# EAGLE design trigger_switch_pcb (EAGLE 6.5.0)
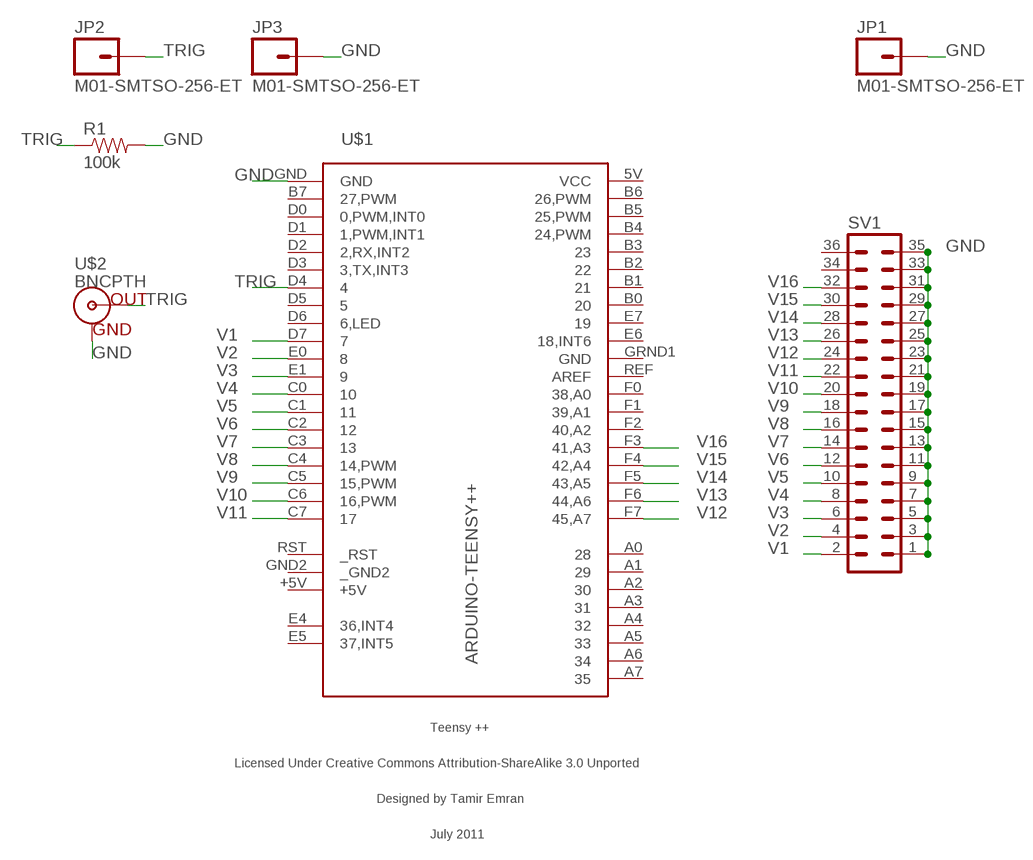
[diagram p0: schematic, sheet 1]

## Parts
JP1  M01-SMTSO-256-ET  [SMTSO-256-ET]
JP2  M01-SMTSO-256-ET  [SMTSO-256-ET]
JP3  M01-SMTSO-256-ET  [SMTSO-256-ET]
R1  100k  RESISTORPTH-1/2W  [AXIAL-0.5]
SV1  MA18-2  [MA18-2]
U$1  ARDUINO-TEENSY++  [TEENSY++]
U$2  BNCPTH  [BNC]

## Nets
GND: JP1.P$1 JP3.P$1 R1.P$2 SV1.1 SV1.3 SV1.5 SV1.7 SV1.9 SV1.11 SV1.13 SV1.15 SV1.17 SV1.19 SV1.21 SV1.23 SV1.25 SV1.27 SV1.29 SV1.31 SV1.33 SV1.35 U$1.GND U$2.GND
TRIG: JP2.P$1 R1.P$1 U$1.D4 U$2.S(OUT)
V1: SV1.2 U$1.D7
V2: SV1.4 U$1.E0
V3: SV1.6 U$1.E1
V4: SV1.8 U$1.C0
V5: SV1.10 U$1.C1
V6: SV1.12 U$1.C2
V7: SV1.14 U$1.C3
V8: SV1.16 U$1.C4(14,PWM)
V9: SV1.18 U$1.C5(15,PWM)
V10: SV1.20 U$1.C6(16,PWM)
V11: SV1.22 U$1.C7
V12: SV1.24 U$1.F7(45,A7)
V13: SV1.26 U$1.F6(44,A6)
V14: SV1.28 U$1.F5(43,A5)
V15: SV1.30 U$1.F4(42,A4)
V16: SV1.32 U$1.F3(41,A3)
Unconnected: SV1.34 SV1.36 U$1.A0 U$1.A1 U$1.A2 U$1.A3 U$1.A4 U$1.A5 U$1.A6 U$1.A7 U$1.B0 U$1.B1 U$1.B2 U$1.B3 U$1.B4(24,PWM) U$1.B5(25,PWM) U$1.B6(26,PWM) U$1.B7(27,PWM) U$1.D0(0,PWM,INT0) U$1.D1(1,PWM,INT1) U$1.D2(2,RX,INT2) U$1.D3(3,TX,INT3) U$1.D5 U$1.D6(6,LED) U$1.E4(36,INT4) U$1.E5(37,INT5) U$1.E6(18,INT6) U$1.E7 U$1.F0(38,A0) U$1.F1(39,A1) U$1.F2(40,A2) U$1.REF(AREF) U$1.RST(_RST)

## Power pins joined to a net without a drawn wire
+5V: U$1.+5V
_GND2: U$1.GND2(_GND2)
GND: U$1.GRND1(GND)
VCC: U$1.5V(VCC)

## Library data of the parts
JP1-JP3 = SparkFun-Connectors:M01: Header 1 Standard 1-pin 0.1" header. Use with straight break away headers (SKU : PRT-00116), right angle break away headers (PRT-00553), swiss pins (PRT-00743), machine pins (PRT-00117), and female headers (PRT-00115).
R1 = SparkFun-Resistors:RESISTOR: Resistor Basic schematic elements and footprints for 0603, 1206, and PTH resistors.
SV1 = con-lstb:MA18-2: PIN HEADER; OC_FARNELL: unknown; OC_NEWARK: unknown
U$1 = teensypp:ARDUINO-TEENSY++: Teensy ++ Original Design by Mark Gross Modified Design by Tamir Emran Licensed Under Creative Commons Attribution-ShareAlike 3.0 Unported (CC BY-SA 3.0)
U$2 = SparkFun-Connectors:BNC: BNC Connector, Mouser Part# 5227161

## Board
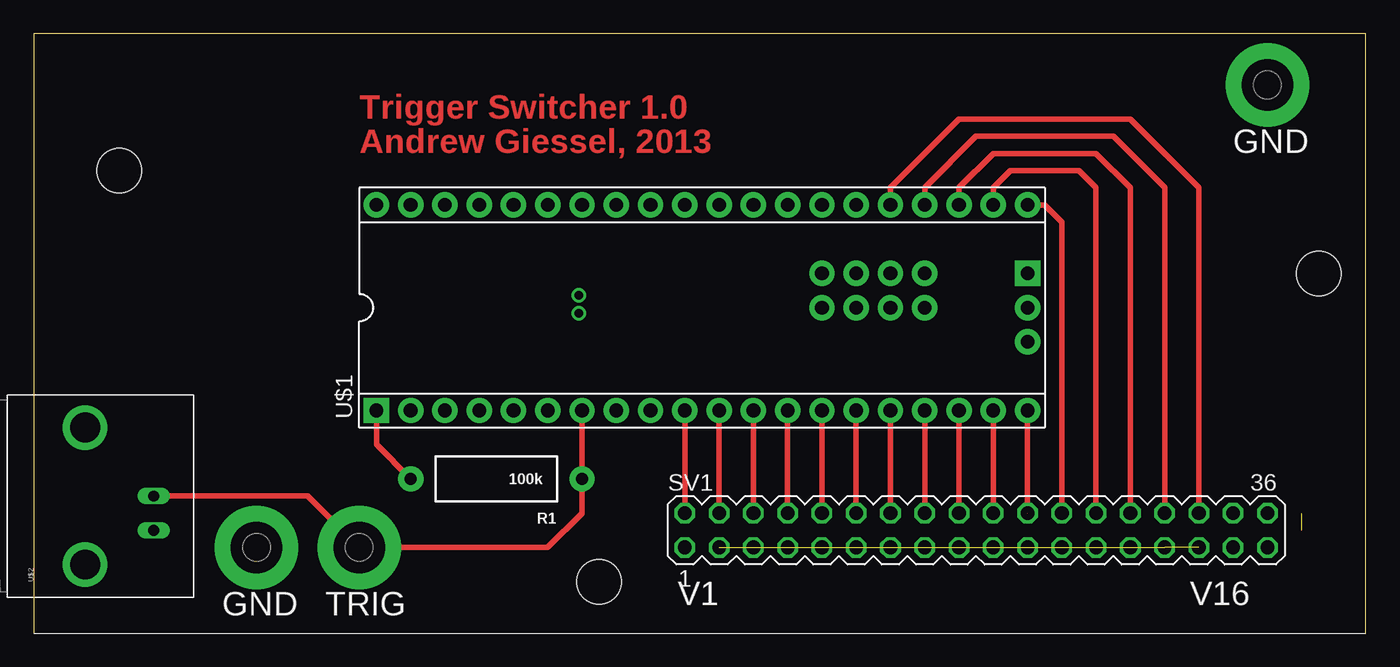
[diagram p1: board, top side]
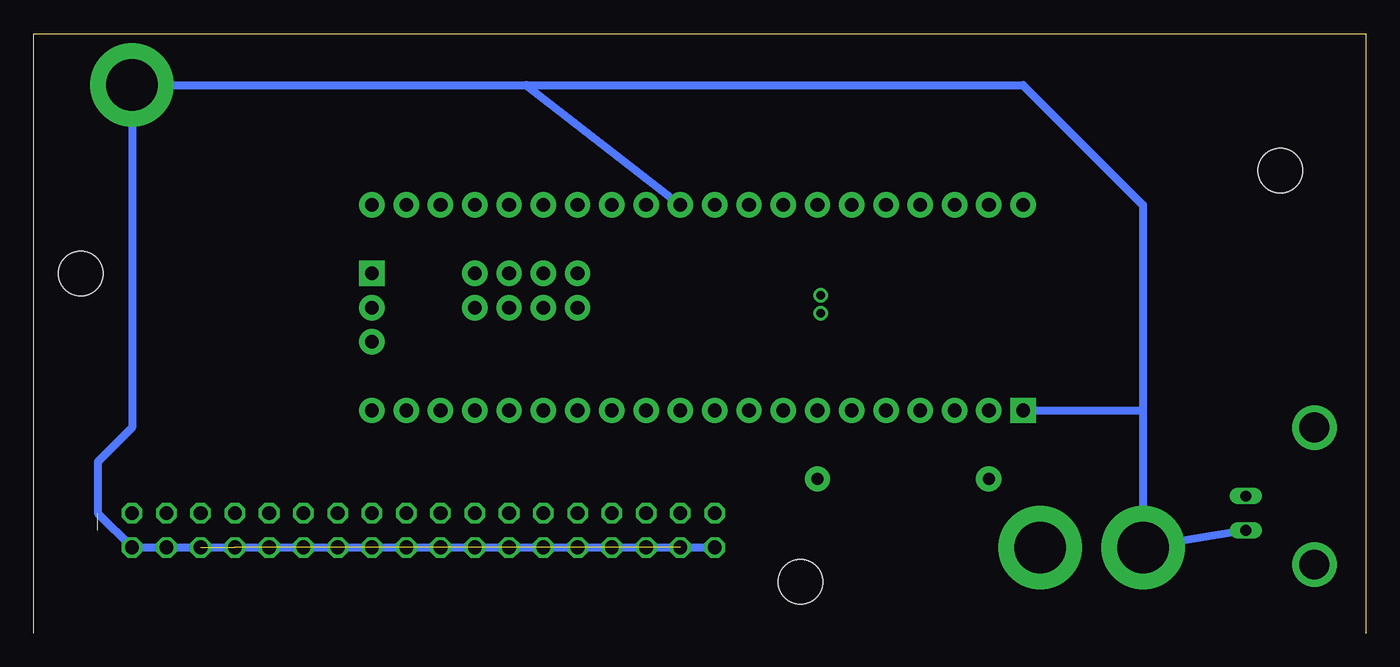
[diagram p2: board, bottom side, seen from below]

Size 98.73 x 44.44 mm. Coordinates in mm from the lower left corner, seen from the top.
Outline: 98.73,0 98.73,44.44 0,44.44 0,0
Copper layers (1*16): Top 0.0178mm / dielectric 59mil / Bottom 0.0178mm
Design rules "SSC-EAGLE-2Lyr_v1.0.0.3": minimum track width 6mil, minimum drill 14mil, track to track 6mil, track to pad 6mil, pad to pad 6mil, via to via 6mil, smd to smd 6mil, copper to edge 20mil, drill to drill 16mil, minimum pad ring 8mil, minimum via ring 8mil, stop-mask expansion 3mil, vias tented up to drill 0mil, thermal gap 10mil

### Footprints (pad centres in the part's own frame; a part is rotated, then mirrored left to right if it is on the bottom)
SMTSO-256-ET = drill 3.81 pad 6.198: P$1 0,0
AXIAL-0.5 = drill 0.9 pad 1.88: P$1 -6.35,0; P$2 6.35,0
MA18-2 = drill 1.016 octagon: 1 -21.59,-1.27; 2 -21.59,1.27; 3 -19.05,-1.27; 4 -19.05,1.27; 5 -16.51,-1.27; 6 -16.51,1.27; 7 -13.97,-1.27; 8 -13.97,1.27; 9 -11.43,-1.27; 10 -11.43,1.27; 11 -8.89,-1.27; 12 -8.89,1.27; 13 -6.35,-1.27; 14 -6.35,1.27; 15 -3.81,-1.27; 16 -3.81,1.27; 17 -1.27,-1.27; 18 -1.27,1.27; 19 1.27,-1.27; 20 1.27,1.27; 21 3.81,-1.27; 22 3.81,1.27; 23 6.35,-1.27; 24 6.35,1.27; 25 8.89,-1.27; 26 8.89,1.27; 27 11.43,-1.27; 28 11.43,1.27; 29 13.97,-1.27; 30 13.97,1.27; 31 16.51,-1.27; 32 16.51,1.27; 33 19.05,-1.27; 34 19.05,1.27; 35 21.59,-1.27; 36 21.59,1.27
TEENSY++ = drill 1.016 pad 1.88: 5V 24.13,-2.54; +5V -24.13,7.62; A0 8.89,0; A1 11.43,0; A2 13.97,0; A3 16.51,0; A4 8.89,2.54; A5 11.43,2.54; A6 13.97,2.54; A7 16.51,2.54; B0 -6.35,7.62; B1 -8.89,7.62; B2 -11.43,7.62; B3 -13.97,7.62; B4 -16.51,7.62; B5 -19.05,7.62; B6 -21.59,7.62; B7 -21.59,-7.62; C0 6.35,-7.62; C1 8.89,-7.62; C2 11.43,-7.62; C3 13.97,-7.62; C4 16.51,-7.62; C5 19.05,-7.62; C6 21.59,-7.62; C7 24.13,-7.62; D0 -19.05,-7.62; D1 -16.51,-7.62; D2 -13.97,-7.62; D3 -11.43,-7.62; D4 -8.89,-7.62; D5 -6.35,-7.62; D6 -3.81,-7.62; D7 -1.27,-7.62; E0 1.27,-7.62; E1 3.81,-7.62; E6 -1.27,7.62; E7 -3.81,7.62; F0 6.35,7.62; F1 8.89,7.62; F2 11.43,7.62; F3 13.97,7.62; F4 16.51,7.62; F5 19.05,7.62; F6 21.59,7.62; F7 24.13,7.62; GND2 24.13,0; GRND1 1.27,7.62; REF 3.81,7.62 | drill 0.635 pad 1.067: E4 -9.144,0.914; E5 -9.144,-0.406 | drill 1.016 pad 1.88 square: GND -24.13,-7.62; RST 24.13,2.54
BNC = drill 2.2: 3 -5.08,5.08; 4 5.08,5.08 | drill 0.8 long: GND -2.54,0; S 0,0
STAND-OFF = hole 3.302: 0,0

### Placement (x,y rotation side)
JP1  91.44,40.64 0 top
JP2  24.13,6.35 0 top
JP3  16.51,6.35 0 top
R1  34.29,11.43 180 top
SV1  69.85,7.62 0 top
U$1  49.53,24.13 0 top
U$2  8.89,10.16 90 top
U$3  [STAND-OFF]  6.35,34.29 0 top
U$4  [STAND-OFF]  95.25,26.67 0 top
U$6  [STAND-OFF]  41.91,3.81 0 top

### Tracks (layer width: path | path; a pad name or v marks a point on that pad's centre or on a via)
GND  (15 unrouted)
  Top 0.406: R1.P$2 25.4,13.97 U$1.GND
  Bottom 0.61: U$2.GND JP3.P$1 16.51,16.51 | 62.23,40.64 JP1.P$1 91.44,15.24 93.98,12.7 93.98,8.89 SV1.35 SV1.33 SV1.31 SV1.1 | 62.23,40.64 25.4,40.64 16.51,31.75 16.51,16.51 | U$1.GRND1 62.23,40.64 | U$1.GND 16.51,16.51
TRIG
  Top 0.406: U$1.D4 R1.P$1 40.64,8.89 38.1,6.35 JP2.P$1 20.32,10.16 U$2.S
V1
  Top 0.406: U$1.D7 SV1.2
V2
  Top 0.406: U$1.E0 SV1.4
V3
  Top 0.406: U$1.E1 SV1.6
V4
  Top 0.406: U$1.C0 SV1.8
V5
  Top 0.406: U$1.C1 SV1.10
V6
  Top 0.406: U$1.C2 SV1.12
V7
  Top 0.406: U$1.C3 SV1.14
V8
  Top 0.406: U$1.C4 SV1.16
V9
  Top 0.406: U$1.C5 SV1.18
V10
  Top 0.406: U$1.C6 SV1.20
V11  (1 unrouted)
  Top 0.406: U$1.C7 SV1.22
V12
  Top 0.406: U$1.F7 74.93,31.75 76.2,30.48 SV1.24
V13
  Top 0.406: U$1.F6 71.12,33.02 72.39,34.29 77.47,34.29 78.74,33.02 SV1.26
V14
  Top 0.406: U$1.F5 68.58,33.02 71.12,35.56 78.74,35.56 81.28,33.02 SV1.28
V15
  Top 0.406: U$1.F4 66.04,33.02 69.85,36.83 80.01,36.83 83.82,33.02 SV1.30
V16
  Top 0.406: U$1.F3 63.5,33.02 68.58,38.1 81.28,38.1 86.36,33.02 SV1.32

### Text on the board
Top: Trigger Switcher 1.0 | Andrew Giessel, 2013
tNames: GND | V1 | V16 | GND | TRIG